# EAGLE design rip_head_2018 (EAGLE 7.7.0)
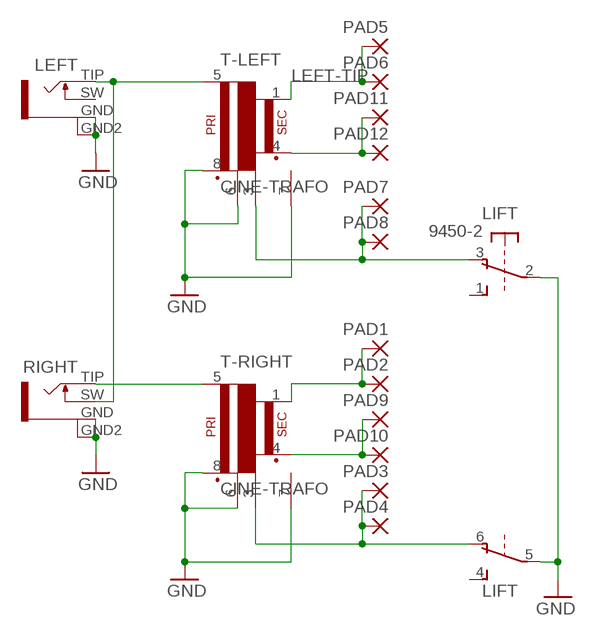
[diagram p0: schematic, sheet 1]

## Parts
LEFT  SHAPES_PONY_ERTHENVAR-JACK  [SHAPES_PONY_3.5MMJACK]
LIFT  9450-2  [9450-2]
PAD1  SMD2  [SMD1,27-2,54]
PAD2  SMD2  [SMD1,27-2,54]
PAD3  SMD2  [SMD1,27-2,54]
PAD4  SMD2  [SMD1,27-2,54]
PAD5  SMD2  [SMD1,27-2,54]
PAD6  SMD2  [SMD1,27-2,54]
PAD7  SMD2  [SMD1,27-2,54]
PAD8  SMD2  [SMD1,27-2,54]
PAD9  SMD2  [SMD1,27-2,54]
PAD10  SMD2  [SMD1,27-2,54]
PAD11  SMD2  [SMD1,27-2,54]
PAD12  SMD2  [SMD1,27-2,54]
RIGHT  SHAPES_PONY_ERTHENVAR-JACK  [SHAPES_PONY_3.5MMJACK]
T-LEFT  CINE-TRAFO  [CIRC-TRAFO]
T-RIGHT  CINE-TRAFO  [CIRC-TRAFO]

## Nets
GND: LEFT.GND LEFT.GND2 LIFT.2(1:P) LIFT.5(2:P) RIGHT.GND RIGHT.GND2 T-LEFT.6(C1) T-LEFT.7(CASE) T-LEFT.8(P2) T-RIGHT.6(C1) T-RIGHT.7(CASE) T-RIGHT.8(P2)
LEFT-GND: LIFT.3(1:O) PAD7.1(P) PAD8.1(P) T-LEFT.3(C2)
LEFT-RING: PAD11.1(P) PAD12.1(P) T-LEFT.4(S2)
LEFT-TIP: PAD5.1(P) PAD6.1(P) T-LEFT.1(S1)
N$1: RIGHT.TIP T-RIGHT.5(P1)
N$8: LEFT.TIP RIGHT.SW T-LEFT.5(P1)
RIGHT-GND: LIFT.6(2:O) PAD3.1(P) PAD4.1(P) T-RIGHT.3(C2)
RIGHT-RING: PAD9.1(P) PAD10.1(P) T-RIGHT.4(S2)
RIGHT-TIP: PAD1.1(P) PAD2.1(P) T-RIGHT.1(S1)
Unconnected: LEFT.SW LIFT.1(1:S) LIFT.4(2:S)

## Library data of the parts
LEFT RIGHT = monome_modular:SHAPES_PONY_ERTHENVAR-JACK
LIFT = switch-misc:9450-2: MARQUARDT SWITCH
PAD1-PAD12 = wirepad:SMD2: SMD PAD
T-LEFT T-RIGHT = monome_modular:CINE-TRAFO

## Board
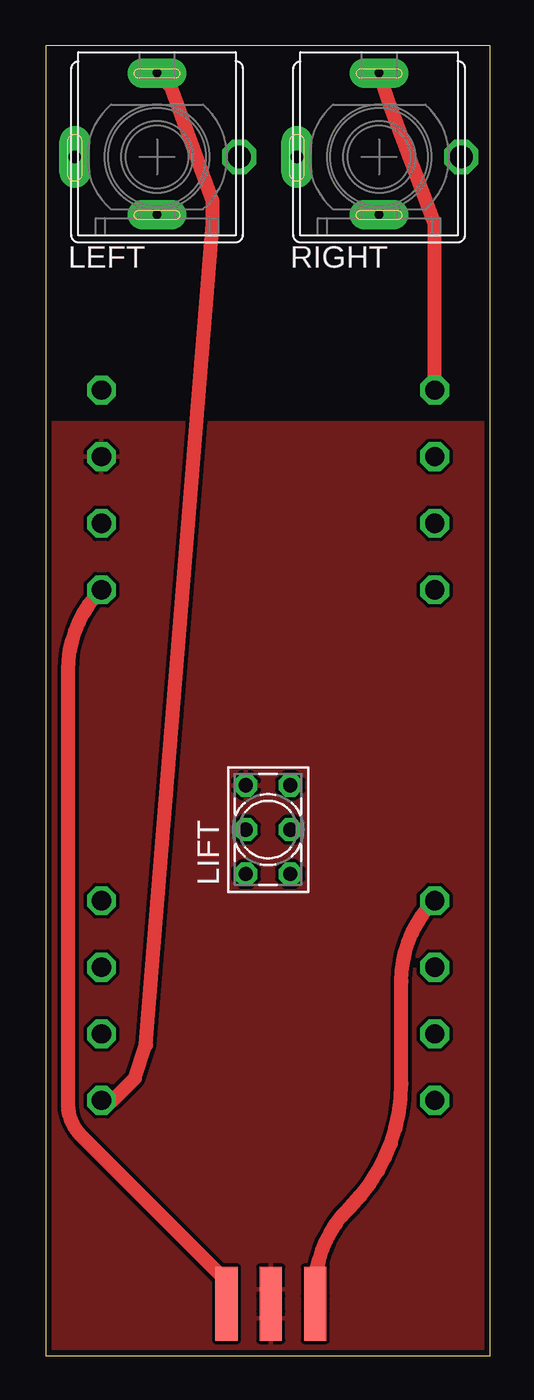
[diagram p1: board, top side]
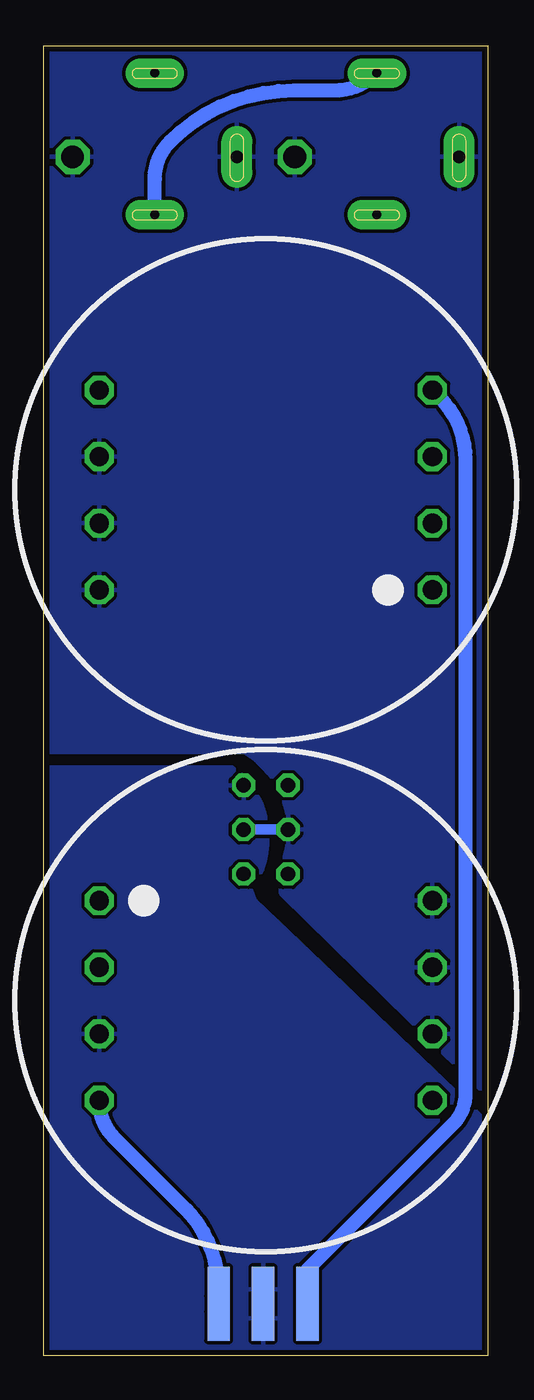
[diagram p2: board, bottom side, seen from below]

Size 25.4 x 74.93 mm. Coordinates in mm from the lower left corner, seen from the top.
Outline: 25.4,74.93 0,74.93 0,0 25.4,0 25.4,74.93
Copper layers (1*16): Top 0.035mm / dielectric 1.5mm / Bottom 0.035mm
Design rules "default *": minimum track width 8mil, minimum drill 15mil, track to track 8mil, track to pad 8mil, pad to pad 8mil, via to via 8mil, smd to smd 8mil, copper to edge 13mil, drill to drill 8mil, minimum pad ring 10mil, minimum via ring 8mil, stop-mask expansion 4mil, vias tented up to drill 24mil, thermal gap 8mil

### Footprints (pad centres in the part's own frame; a part is rotated, then mirrored left to right if it is on the bottom)
SHAPES_PONY_3.5MMJACK = drill 0.7 pad 1.778 long: GND -4.7,0 | drill 1.3 octagon: GND2 4.7,0 | drill 0.5 pad 1.676 long: SW 0,-3.3; TIP 0,4.8
9450-2 = drill 0.813 octagon: 1 -2.54,-1.27; 2 0,-1.27; 3 2.54,-1.27; 4 -2.54,1.27; 5 0,1.27; 6 2.54,1.27
SMD1,27-2,54 = smd 1.27 x 2.54: 1 0,0
CIRC-TRAFO = drill 1.1 octagon: 1 -9.525,5.715; 2 -9.525,1.905; 3 -9.525,-1.905; 4 -9.525,-5.715; 5 9.525,-5.715; 6 9.525,-1.905; 7 9.525,1.905; 8 9.525,5.715

### Placement (x,y rotation side)
LEFT  6.35,68.58 0 top
LIFT  12.7,30.1 90 top
PAD1  10.32,2.14 0 top
PAD2  10.32,3.81 0 top
PAD3  12.86,3.81 0 top
PAD4  12.86,2.14 0 top
PAD5  15.4,3.81 0 top
PAD6  15.4,2.14 0 top
PAD7  12.86,2.14 180 bottom
PAD8  12.86,3.81 180 bottom
PAD9  10.32,2.14 0 bottom
PAD10  10.32,3.81 0 bottom
PAD11  15.4,2.14 0 bottom
PAD12  15.4,3.81 0 bottom
RIGHT  19.05,68.58 0 top
T-LEFT  12.7,20.32 0 bottom
T-RIGHT  12.7,49.53 180 bottom

### Tracks (layer width: path | path; a pad name or v marks a point on that pad's centre or on a via)
GND
  Bottom 0.61: LIFT.5 LIFT.2
  pour Bottom: 0,74.93 25.4,74.93 25.4,34.53 13.97,34.53 arc90 12.06,27.54 11.83,26.43 0,14.84
LEFT-GND
  Bottom 0.813: PAD7.1 PAD8.1
  pour Bottom: 0,0 25.4,0 25.4,33.66 14.61,33.66 arc90 13.57,26.67 13.34,26.04 0,13.34
LEFT-RING
  Bottom 0.813: PAD11.1 PAD12.1 arc-45 17.31,8.42 21.33,12.44 arc45 T-LEFT.4
LEFT-TIP
  Top 0.813: PAD6.1 PAD5.1 arc-45 17.31,8.42 17.39,8.5 arc45 20.32,15.57 20.32,21.44 arc-45 T-LEFT.1
N$1
  Top 0.813: T-RIGHT.5 22.23,64.77 19.68,71.52 19.68,71.47 RIGHT.TIP
N$8
  Top 0.813: T-LEFT.5 3.81,14.61 5.08,15.88 5.71,17.78 9.53,64.77 9.53,66.04 6.99,73.02 6.99,72.74 LEFT.TIP
  Bottom 0.813: RIGHT.SW 19.05,67.33 arc45 18.17,69.46 arc45 11.1,72.39 8.74,72.39 arc-45 LEFT.TIP
RIGHT-GND
  Top 0.813: PAD3.1 PAD4.1
  pour Top: 0,0 25.4,0 25.4,53.34 0,53.34
RIGHT-RING
  Bottom 0.813: PAD9.1 PAD10.1 10.32,4.92 2.01,13.23 arc-45 1.27,15.02 1.27,51.27 arc-45 2.73,54.8 T-RIGHT.4
RIGHT-TIP
  Top 0.254: 9.92,1.35 PAD1.1
  Top 0.813: PAD1.1 PAD2.1 10.32,4.29 2.01,12.59 arc-45 1.27,14.39 1.27,39.22 arc-45 T-RIGHT.1

### Text on the board
tStop: do you lift bruh?
bStop: Mannequins / RIP_DIY / 180129 | 1 solder switch / 2 trim switch pins / 3 TAPE OVER PINS! / 4 install xformers